# EasyEDA Pro project Motor_Sense_2025-12-15_V1.epro, board PCB_1
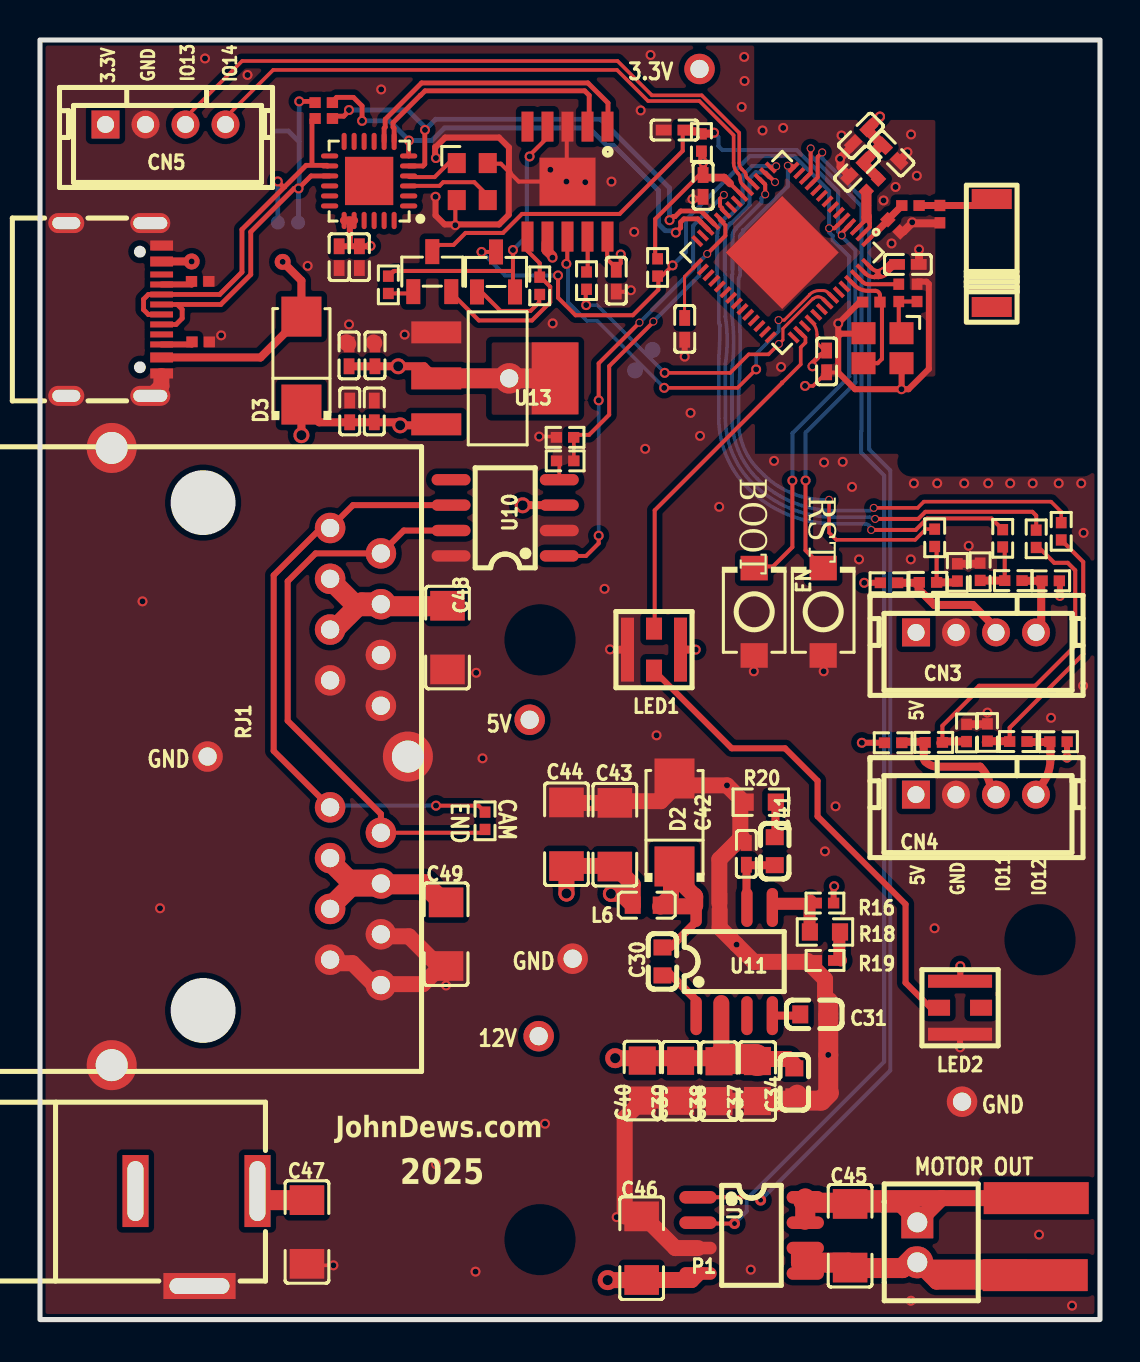
[diagram p3: board, top side]
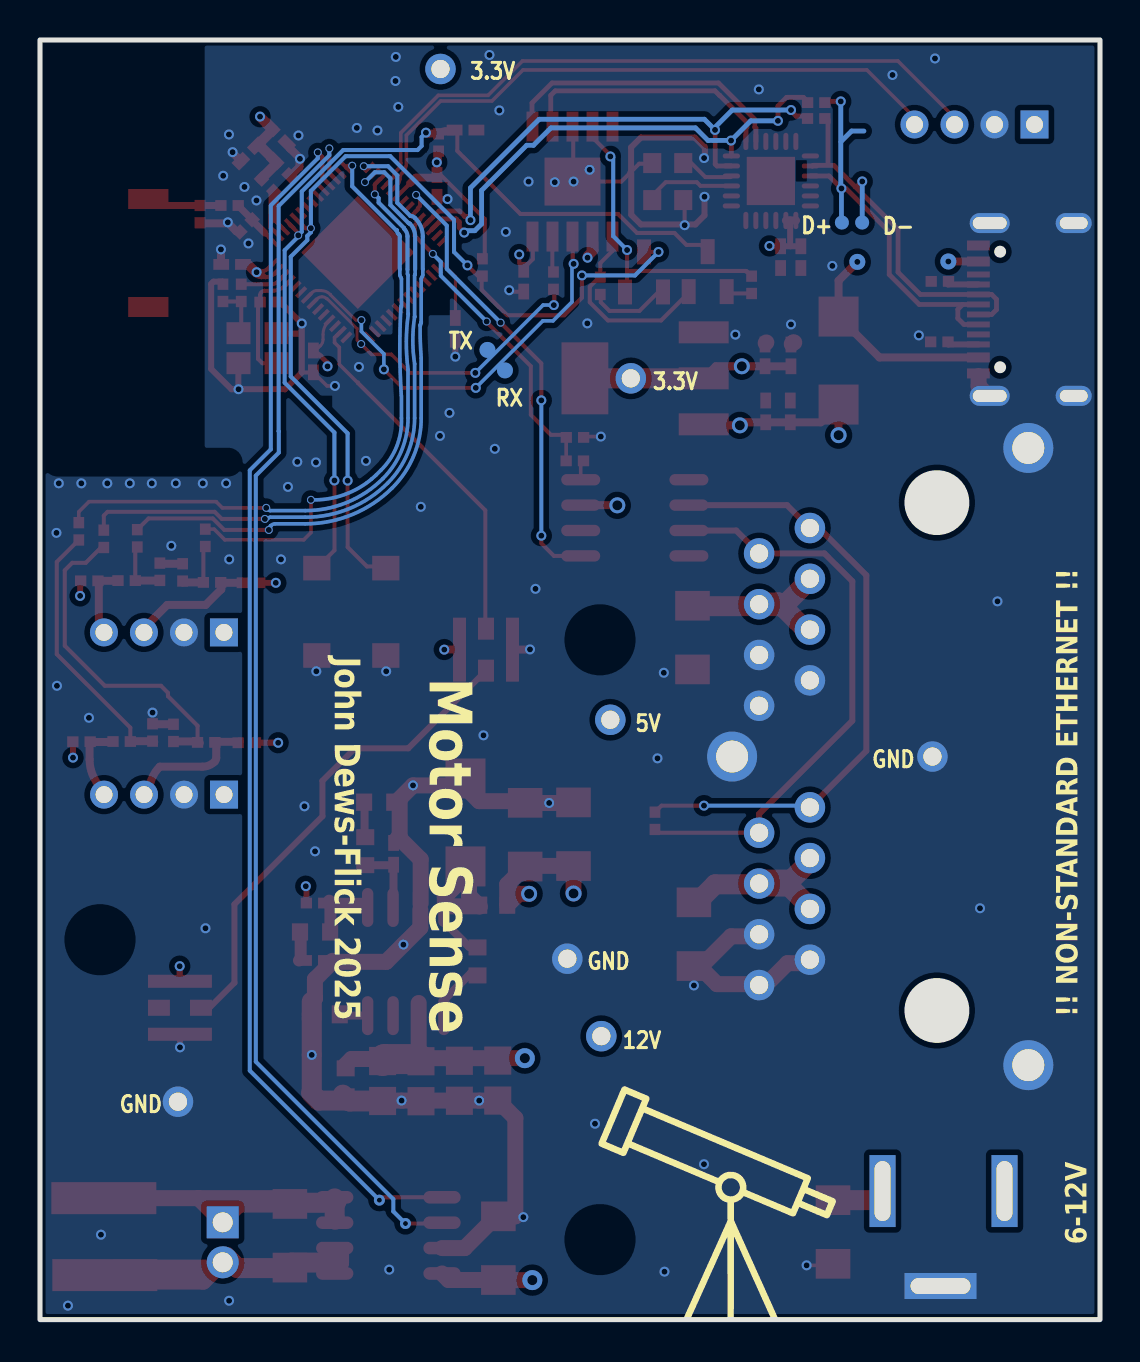
[diagram p4: board, bottom side, seen from below]

Outline 53 x 64 mm; copper layers: Top Layer, GND, VCC, Bottom Layer. Coordinates in mm from the lower left corner of the outline.
Outline path: rectangle 0,64 53,0
Stack: Top Layer 0.035mm Outer layer thickness 1oz / Dielectric1 0.2104mm 7628 RC49% 8.6mil / GND 0.0152mm 内层铜厚 / Dielectric2 1.065mm 1.1mm H/HOZ Copper / VCC 0.0152mm 内层铜厚 / Dielectric3 0.2104mm 7628 RC49% 8.6mil / Bottom Layer 0.035mm Outer layer thickness 1oz

## Design rules (mm)
net D4-: DP2
net D4+: DP2
net D3+: DP3
net D3-: DP3
net USB_D+: DP1
net USB_D-: DP1
template: 自定义配置
spacing copperThickness1oz (default): track to track 0.102, other pairs 0 to 0.3
spacing copperThickness2oz: track to track 0.203, other pairs 0.152 to 0.3
track width copperThickness1oz (default): min 0.152, default 0.203, max 2.54
track width copperThickness2oz: min 0.203, default 0.254, max 2.54
differential pair 90Ω (default): width min 0.241, default 0.241, max 0.241; gap min 0.152, default 0.152
via viaSize (default): diameter min 0.25, default 0.508, max 2.54; hole min 0.15, default 0.305, max 0.508

## Placement (name value [footprint] x y rotation side)
BOOT  TS-1088-AR02016  [SW-SMD_L3.9-W3.0-P4.45]  35.71 35.4 90 top
C1  8.2pF  [r0402]  43.52 55.72 180 top
C2  100nF  [C0402]  43.4 52.78 180 top
C3  10uF  [C0402]  41.05 59.21 45 top
C4  1uF  [C0402]  42.57 58.33 135 top
C5  100nF  [C0402]  40.85 57.56 45 top
C6  100nF  [C0402]  33.15 56.7 90 top
C7  100nF  [C0402]  39.33 47.92 90 top
C8  100nF  [C0402]  28.81 51.96 90 top
C9  10uF  [C0402]  14.96 53.14 90 top
C10  100nF  [C0402]  15.97 53.14 90 top
C11  100nF  [C0402]  32.23 49.55 90 top
C12  10pF  [R0402]  41.57 50.89 180 top
C13  1uF  [C0402]  31.72 59.5 0 top
C14  10pF  [R0402]  43.85 51.35 270 top
C15  10uF  [C0402]  16.75 48.23 270 top
C16  100nF  [C0402]  15.45 48.22 270 top
C17  10uF  [C0402]  15.48 45.42 270 top
C18  100nF  [C0402]  16.72 45.42 270 top
C30  100nF  [C0603]  31.12 17.91 90 top
C31  10nF  [C0603]  38.71 15.27 180 top
C34  10nF  [C0603]  37.72 11.87 90 top
C37  4.7uF  [C0805]  35.87 11.93 90 top
C38  4.7uF  [C0805]  33.95 11.92 90 top
C39  4.7uF  [C0805]  32.03 11.95 90 top
C40  4.7uF  [C0805]  30.11 11.95 90 top
C41  4.7nF  [C0603]  36.74 23.43 270 top
C42  33pF  [C0402]  35.32 23.3 270 top
C43  22uF  [C1206]  28.74 24.25 90 top
C44  22uF  [C1206]  26.32 24.27 90 top
C45  100nF  [C1206]  40.5 4.19 90 top
C46  100nF  [C1206]  30.08 3.57 90 top
C47  22uF  [C1206]  13.35 4.38 270 top
C48  100nF  [C1206]  20.38 34.11 90 top
C49  100nF  [C1206]  20.3 19.28 90 top
CN3  PH-4A  [CONN-TH_PH-4A]  46.8 34.37 0 top
CN4  PH-4A  [CONN-TH_PH-4A]  46.8 26.26 0 top
CN5  PH-4A  [CONN-TH_PH-4A]  6.28 59.77 0 top
D2  SS34  [SMA_L4.3-W2.6-LS5.2-RD]  31.73 24.86 90 top
D3  SS34  [SMA_L4.3-W2.6-LS5.2-RD]  13.07 47.97 90 top
EN  TS-1088-AR02016  [SW-SMD_L3.9-W3.0-P4.45]  39.16 35.4 90 top
L1  1.3nH  [r0402]  45 55.29 270 top
L2  39nH  [r0402]  42.7 54.71 315 top
L3  2nH  [R0402]  41.62 56.74 225 top
L4  24nH  [r0402]  42.94 51.35 270 top
L6  10uH  [L0603]  30.34 20.73 180 top
LED1  XL-3332RGBC-WS2812B  [LED-SMD_4P-L3.3-W3.2_XL-3332RGBC-WS2812B]  30.7 33.51 270 top
LED2  XL-3332RGBC-WS2812B  [LED-SMD_4P-L3.3-W3.2_XL-3332RGBC-WS2812B]  46 15.6 0 top
NOREF  -  [Pad_e433]  23.46 47.08 0 top
NOREF#2  -  [Pad_e755]  8.38 28.16 0 top
NOREF#3  -  [Pad_e2556]  29.75 47.47 0 top
NOREF#4  -  [Pad_e3200]  24.48 30 0 top
NOREF#5  -  [Pad_e3508]  46.1 10.9 0 top
NOREF#6  -  [Pad_e3152]  49.76 2.22 0 top
NOREF#7  -  [Pad_e3151]  49.81 6.07 0 top
NOREF#8  -  [Pad_e2540]  32.98 62.55 0 top
NOREF#9  -  [Pad_e2558]  30.63 48.5 0 top
NOREF#10  -  [Pad_e3207]  26.63 18.05 0 top
NOREF#11  -  [Pad_e3199]  24.93 14.18 0 top
P1  PH-2A  [CONN-TH_2P-P2.00_PH-2A_C2319]  43.86 3.86 90 top
Q1  MMBT3904(RANGE:100-300)  [SOT-23-3_L2.9-W1.3-P1.90-LS2.4-BR]  22.8 52.4 270 top
Q2  MMBT3904(RANGE:100-300)  [SOT-23-3_L2.9-W1.3-P1.90-LS2.4-BR]  19.62 52.41 270 top
R1  0Ω  [R0402]  14.19 60.87 0 top
R2  0Ω  [R0402]  14.19 60.07 0 top
R3  100Ω  [R0402]  27.33 51.96 90 top
R4  4.7kΩ  [R0402]  24.99 51.7 270 top
R5  4.7kΩ  [R0402]  17.42 51.75 270 top
R7  4.7kΩ  [R0402]  33.07 58.87 270 top
R8  4.7kΩ  [R0402]  30.88 52.62 90 top
R9  5.1kΩ  [R0402]  8.03 48.9 180 top
R10  5.1kΩ  [R0402]  8.01 51.93 180 top
R16  10kΩ  [R0402]  39.25 20.83 0 top
R18  1.8kΩ  [R0603]  39.25 19.39 180 top
R19  100Ω  [R0402]  39.25 17.96 0 top
R20  49.9Ω  [R0603]  36.04 25.88 0 top
R21  10kΩ  [R0402]  44.4 36.87 0 top
R22  20kΩ  [R0402]  45.87 37.37 90 top
R23  10kΩ  [R0402]  42.45 36.85 0 top
R24  10kΩ  [R0402]  48.67 36.96 180 top
R25  20kΩ  [R0402]  47.01 37.4 90 top
R26  10kΩ  [R0402]  50.53 36.95 180 top
R28  100Ω  [R0402]  44.73 39.1 90 top
R29  100Ω  [R0402]  48.13 39.08 90 top
R30  10kΩ  [R0402]  44.69 28.87 0 top
R31  20kΩ  [R0402]  46.33 29.34 90 top
R32  10kΩ  [R0402]  42.66 28.85 0 top
R33  10kΩ  [R0402]  48.92 28.91 180 top
R34  20kΩ  [R0402]  47.37 29.37 90 top
R35  10kΩ  [R0402]  50.93 28.9 180 top
R36  100Ω  [R0402]  49.81 39.05 90 top
R37  100Ω  [R0402]  51.06 39.43 90 top
R38  2kΩ  [R0402]  26.25 44.13 0 top
R39  1kΩ  [R0402]  26.26 42.95 180 top
R40  120Ω  [R0402]  22.25 24.95 270 top
RJ1  DS1129-05-S80BP-X  [RJ45-TH_DS1129-05-S80BP-X]  10.99 28.16 270 top
TP1  -  [test-point-0.5mm]  12.91 54.87 90 bottom
TP2  -  [test-point-0.5mm]  11.89 54.87 90 bottom
U1  RFANT5220110A0T  [FILTER-SMD_L5.2-W2.0-L]  47.59 53.35 90 top
U2  ESP32-S3FN8  [QFN-56_L7.0-W7.0-P0.40-TL-EP4.0]  37.11 53.37 225 top
U3  CH340K  [ESOP-10_L4.9-W3.9-P1.00-LS6.2-BL-EP]  26.37 56.92 180 top
U4  CH334F  [qfn24_4x4]  16.46 56.95 90 top
U6  USB-TYPE-C-019  [TYPE-C-SMD_HX-TYPE-C-16PIN]  3.7 50.52 270 top
U9  BL5617  [SOP-8_L4.9-W3.9-P1.27-LS6.0-BL]  35.58 4.21 270 top
U10  TJA1050T/CM,118  [SOIC-8_L5.0-W4.0-P1.27-LS6.0-BL]  23.26 40.1 90 top
U11  TPS54331DR  [SOIC-8_L5.0-W4.0-P1.27-LS6.0-BL]  34.71 17.91 0 top
U12  ZX-DC-WC2.56.3  [DC-TH_ZX-DC-WC2.56.3]  7.82 4.05 0 top
U13  AMS1117-3.3  [SOT-223-3_L6.5-W3.4-P2.30-LS7.0-BR]  22.78 47.08 180 top
X1  12MHz  [crystal-smd_4p-l2.5-w2.0-bl-a]  21.61 56.92 270 top
X2  40MHz  [crystal-smd_4p-l2.5-w2.0-bl]  42.12 48.58 180 top

## Footprints (pads in the part's own frame, mm; a bottom-side part is the same pattern mirrored in y, then rotated)
C0402
  rect 0.79x0.54 smd: 1(-0.545,0) 2(0.545,0)
C0603
  rect 0.8x0.9 smd: 1(-0.7,0) 2(0.7,0)
C0805
  rect 1.41x1.35 smd: 1(-1,0) 2(1,0)
C1206
  rect 1.485x1.728 smd: 1(-1.593,0) 2(1.593,0)
CONN-TH_2P-P2.00_PH-2A_C2319
  rect 1.6x1.6 hole 1: 1(1,0)
  round 1.6 hole 1: 2(-1,0)
CONN-TH_PH-4A
  rect 1.4x1.4 hole 0.85: 1(-3,0)
  round 1.4 hole 0.85: 2(-1,0) 3(1,0) 4(3,0)
crystal-smd_4p-l2.5-w2.0-bl
  rect 1.2x1.1 smd: 1(-0.95,-0.75) 2(0.95,-0.75) 3(0.95,0.75) 4(-0.95,0.75)
crystal-smd_4p-l2.5-w2.0-bl-a
  rect 1x0.9 smd: 1(-0.925,-0.775) 2(0.925,-0.775) 3(0.925,0.775) 4(-0.925,0.775)
DC-TH_ZX-DC-WC2.56.3
  rect 1.3x3.6 hole 0.8x3: 1(3.05,2.375) 2(-3.05,2.375)
  rect 3.6x1.3 hole 3x0.8: 3(0.15,-2.375)
ESOP-10_L4.9-W3.9-P1.00-LS6.2-BL-EP
  rect 0.6x1.5 smd: 1(-2,-2.75) 2(-1,-2.75) 3(0,-2.75) 4(1,-2.75) 5(2,-2.75) 6(2,2.75) 7(1,2.75) 8(0,2.75) 9(-1,2.75) 10(-2,2.75)
  rect 2.8x2.4 smd: 11(0,0)
FILTER-SMD_L5.2-W2.0-L
  rect 1x2 smd: 1(-2.7,0) 2(2.7,0)
L0603
  rect 0.8x0.864 smd: 1(-0.7,0) 2(0.7,0)
LED-SMD_4P-L3.3-W3.2_XL-3332RGBC-WS2812B
  rect 3.2x0.65 smd: 1(0,1.325) 4(0,-1.325)
  rect 1.1x0.8 smd: 2(-1.05,0) 3(1.05,0)
Pad_e433
  round 1.524 hole 0.914: 1(0,0)
Pad_e755
  round 1.524 hole 0.914: 1(0,0)
Pad_e2540
  round 1.524 hole 0.914: 2(0,0)
Pad_e2556
  round 0.8 smd far side: 1(0,0)
Pad_e2558
  round 0.8 smd far side: 1(0,0)
Pad_e3151
  custom 5.251x1.6 smd: 1(0,0)
Pad_e3152
  custom 5.251x1.6 smd: 1(0,0)
Pad_e3199
  round 1.524 hole 0.914: 1(0,0)
Pad_e3200
  round 1.524 hole 0.914: 2(0,0)
Pad_e3207
  round 1.524 hole 0.914: 1(0,0)
Pad_e3508
  round 1.524 hole 0.914: 1(0,0)
qfn24_4x4
  rect 2.413x2.413 smd: 0(0,0)
  oval 0.25x0.864 smd: 1(-1.25,-1.976) 2(-0.75,-1.976) 3(-0.25,-1.976) 4(0.25,-1.976) 5(0.75,-1.976) 6(1.25,-1.976) 13(1.25,1.976) 14(0.75,1.976) 15(0.25,1.976) 16(-0.25,1.976) 17(-0.75,1.976) 18(-1.25,1.976)
  oval 0.864x0.25 smd: 7(1.976,-1.25) 8(1.976,-0.75) 9(1.976,-0.25) 10(1.976,0.25) 11(1.976,0.75) 12(1.976,1.25) 19(-1.976,1.25) 20(-1.976,0.75) 21(-1.976,0.25) 22(-1.976,-0.25) 23(-1.976,-0.75) 24(-1.976,-1.25)
QFN-56_L7.0-W7.0-P0.40-TL-EP4.0
  rect 0.665x0.2 smd: 1(-3.408,2.6) 2(-3.407,2.2) 3(-3.408,1.8) 4(-3.408,1.4) 5(-3.408,1) 6(-3.407,0.6) 7(-3.408,0.2) 8(-3.408,-0.2) 9(-3.407,-0.6) 10(-3.408,-1) 11(-3.408,-1.4) 12(-3.408,-1.8) 13(-3.407,-2.2) 14(-3.408,-2.6) 29(3.408,-2.6) 30(3.407,-2.2) 31(3.408,-1.8) 32(3.408,-1.4) 33(3.408,-1) 34(3.407,-0.6) 35(3.408,-0.2) 36(3.408,0.2) 37(3.407,0.6) 38(3.408,1) 39(3.408,1.4) 40(3.408,1.8) 41(3.407,2.2) 42(3.408,2.6)
  rect 0.2x0.665 smd: 15(-2.6,-3.408) 16(-2.2,-3.407) 17(-1.8,-3.408) 18(-1.4,-3.408) 19(-1,-3.408) 20(-0.6,-3.407) 21(-0.2,-3.408) 22(0.2,-3.408) 23(0.6,-3.407) 24(1,-3.408) 25(1.4,-3.408) 26(1.8,-3.408) 27(2.2,-3.407) 28(2.6,-3.408) 43(2.6,3.408) 44(2.2,3.407) 45(1.8,3.408) 46(1.4,3.408) 47(1,3.408) 48(0.6,3.407) 49(0.2,3.408) 50(-0.2,3.408) 51(-0.6,3.407) 52(-1,3.408) 53(-1.4,3.408) 54(-1.8,3.408) 55(-2.2,3.407) 56(-2.6,3.408)
  rect 4x4 smd: 57(0,0)
r0402
  rect 0.566x0.54 smd: 1(-0.433,0) 2(0.433,0)
R0402
  rect 0.566x0.54 smd: 1(-0.433,0) 2(0.433,0)
R0603
  rect 0.806x0.864 smd: 1(-0.753,0) 2(0.753,0)
RJ45-TH_DS1129-05-S80BP-X
  round 1.524 hole 0.914: 1(-11.43,3.515) 2(-10.16,6.055) 3(-8.89,3.515) 4(-7.62,6.055) 5(-6.35,3.515) 6(-5.08,6.055) 7(-3.81,3.515) 8(-2.54,6.055) 9(2.54,3.515) 10(3.81,6.055) 11(5.08,3.515) 12(6.35,6.055) 13(7.62,3.515) 14(8.89,6.055) 15(10.16,3.515) 16(11.43,6.055)
  round 2.5 hole 1.6: 17(-15.435,-7.405) 18(15.435,-7.405) 19(0.001,7.405)
SMA_L4.3-W2.6-LS5.2-RD
  rect 2x2 smd: 1(-2.2,0) 2(2.2,0)
SOIC-8_L5.0-W4.0-P1.27-LS6.0-BL
  oval 0.569x1.95 smd: 1(-1.905,-2.705) 2(-0.635,-2.705) 3(0.635,-2.705) 4(1.905,-2.705) 5(1.905,2.705) 6(0.635,2.705) 7(-0.635,2.705) 8(-1.905,2.705)
SOP-8_L4.9-W3.9-P1.27-LS6.0-BL
  oval 0.63x1.865 smd: 1(-1.905,-2.683) 2(-0.635,-2.683) 3(0.635,-2.683) 4(1.905,-2.683) 5(1.905,2.683) 6(0.635,2.683) 7(-0.635,2.683) 8(-1.905,2.683)
SOT-23-3_L2.9-W1.3-P1.90-LS2.4-BR
  rect 1.25x0.7 smd: 1(1,-0.95) 2(1,0.95) 3(-1,0)
SOT-223-3_L6.5-W3.4-P2.30-LS7.0-BR
  rect 2.5x1.1 smd: 1(2.97,-2.3) 2(2.97,0) 3(2.97,2.3)
  rect 2.34x3.6 smd: 4(-2.97,0)
SW-SMD_L3.9-W3.0-P4.45
  rect 1.23x1.36 smd: 1(-2.185,0) 2(2.185,0)
test-point-0.5mm
  round 0.7 smd: 1(0,0)
TYPE-C-SMD_HX-TYPE-C-16PIN
  oval 1x2 hole 0.6x1.7: 1(-4.32,1.816) 1(4.32,1.816)
  oval 1x1.8 hole 0.6x1.4: 1(-4.32,-2.384) 1(4.32,-2.384)
  rect 0.5x1.14 smd: A1(-3.2,2.384) A4(-2.4,2.384) A9(2.4,2.384) A12(3.2,2.384)
  rect 0.3x1.14 smd: A5(-1.25,2.383) A6(-0.25,2.383) A7(0.25,2.383) A8(1.25,2.384) B5(1.75,2.383) B6(0.75,2.383) B7(-0.75,2.383) B8(-1.75,2.384)

## Nets
As in the schematic, except:
3V3: C2.2 C3.2 C4.2 C5.2 C6.2 C7.2 C8.2 C9.2 C10.2 C15.2 C16.2 CN5.1 L3.1 NOREF.1 NOREF#8.2 R7.2 R8.2 U2.20 U2.46 U2.55 U2.56 U3.7 U3.10 U4.19 U4.20 U13.2 U13.4
12V: C34.2 C37.2 C38.2 C39.2 C40.2 C46.1 C47.1 C48.2 C49.2 NOREF#11.1 RJ1.3 RJ1.4 RJ1.5 RJ1.11 RJ1.12 RJ1.13 U9.4 U11.2 U12.1
+5V: C17.2 C18.2 C43.1 C44.1 CN3.1 CN4.1 D3.1 L6.2 LED1.1 LED2.1 NOREF#4.2 R16.2 R23.1 R26.1 R32.1 R35.1 U10.3 U13.3
GND: BOOT.1 C2.1 C3.1 C4.1 C5.1 C6.1 C7.1 C8.1 C9.1 C10.1 C11.1 C12.2 C13.1 C14.1 C15.1 C16.1 C17.1 C18.1 C31.1 C34.1 C37.1 C38.1 C39.1 C40.1 C42.1 C43.2 C44.2 C46.2 C47.2 C48.1 C49.1 CN3.2 CN4.2 CN5.2 D2.2 EN.1 L1.2 L2.2 LED1.4 LED2.4 NOREF#2.1 NOREF#5.1 NOREF#10.1 R9.1 R10.1 R19.1 R20.1 R22.2 R25.2 R31.2 R34.2 R38.1 RJ1.6 RJ1.7 RJ1.8 RJ1.14 RJ1.15 RJ1.16 RJ1.17 RJ1.18 RJ1.19 U2.57 U3.3 U3.11 U4.0 U6.1 U6.A1 U6.A12 U9.3 U10.2 U10.8 U11.7 U12.3 U13.1 X1.2 X1.4 X2.2 X2.4
340_TX: NOREF#3.1 U2.50 U3.8
M_OUTA: C45.2 NOREF#7.1 P1.1 U9.7 U9.8
M_OUTB: C45.1 NOREF#6.1 P1.2 U9.5 U9.6
U0TX: NOREF#9.1 R3.1 U2.49

Pads without a net: U1 1; U2 28 30 31 32 33 34 35 38 39 40 41 42; U3 5; U4 1 2 9 10 11 12 13 16 17 18 21 22 23 24; U6 A8 B8; U10 5; U11 3; U12 2

## Via types
v1: diameter 0.5, hole 0.3, Top Layer to Bottom Layer, 132 vias
v2: diameter 0.8, hole 0.5, Top Layer to Bottom Layer, 6 vias
v3: diameter 0.4, hole 0.3, Top Layer to Bottom Layer, 18 vias
v4: diameter 1, hole 0.508, Top Layer to Bottom Layer, 2 vias
v5: diameter 0.55, hole 0.25, Top Layer to Bottom Layer, 2 vias
v6: diameter 0.8, hole 0.3, Top Layer to Bottom Layer, 2 vias

## Routing (per net, layer and track width the routed paths; a pad name or vN(x,y) marks a point on that pad's centre or on a via; arc(x,y) is an arc through that point)
3V3: length 40.4
  Top Layer w0.152: 38.98,48.71 39.33,48.36 ; U2.46 38.58,49.92 arc(38.78,49.62) 38.85,49.27 38.85,49.02 arc(38.88,48.85) 38.98,48.71
  Top Layer w0.2: 15.21,54.97 15.21,55.27 ; 15.89,53.74 15.91,53.72
  Top Layer w0.203: 28.8,52.6 28.36,53.04 28.36,54.12 ; 28.8,52.6 28.81,52.58 ; 28.8,52.6 28.77,52.56 ; 28.8,52.6 29.03,52.83 29.03,53.25 ; 42.24,52.61 42.48,52.85 arc(42.58,52.92) 42.71,52.94 ; 42.24,52.61 arc(42.16,52.54) 42.08,52.5 ; 42.24,52.61 arc(42.34,52.66) 42.44,52.7 ; 42.24,52.61 arc(42.16,52.55) 42.08,52.5 ; 41.92,52.14 v1(42.17,52.39) 42.41,52.63 arc(42.44,52.66) 42.44,52.7 ; 41.92,52.14 41.72,52.14 ; 41.92,52.14 arc(42.16,52.19) 42.35,52.32 42.7,52.67 arc(42.82,52.75) 42.96,52.78 42.86,52.78 arc(42.65,52.76) 42.44,52.7 ; 15.85,53.67 15.85,53.74 15.89,53.74 ; 41.83,52.44 41.84,52.44 arc(41.97,52.46) 42.08,52.5 ; 41.83,52.44 arc(41.91,52.43) 42,52.42 ; 41.83,52.44 arc(41.68,52.5) 41.55,52.6 U2.56 ; 34.5,56.86 34.5,56.82 U2.20 ; U2.55 41.26,52.33 arc(41.47,52.19) 41.72,52.14 ; 30.76,53.03 30.76,55.05 32.96,57.25 ; 41.72,52.14 42,52.42 ; 42,52.42 arc(42.04,52.46) 42.08,52.5
  Top Layer w0.241: v1(38.62,47.68) 38.62,47.85 38.99,48.21 arc(39.14,48.32) 39.33,48.36
  Top Layer w0.3: 15.47,53.68 15.49,53.7 15.49,54.97 ; 15.47,53.68 16.51,53.68 v1(16.53,53.7) ; 15.47,53.68 14.91,53.68
  Top Layer w0.381: v1(33.16,57.88) 33.16,57.12 34.21,57.12 34.5,56.82
  Top Layer w0.4: U4.19 U4.20 ; C16.2 16.75,47.68 C15.2 v2(17.91,47.68) 19.21,47.68 U13.2 ; 33.12,58.47 33.12,57.94 33.15,57.91
  Top Layer w0.5: 25.61,53.19 25.33,53.48 25.33,53.86
  Top Layer w0.508: 42.26,58.63 42.24,58.63 42.08,58.79 ; 42.08,58.79 41.16,57.87 41.16,57.84 41.95,57.05 ; 42.08,58.79 41.35,59.52 v1(42,60.17)
  Top Layer w1: U13.4 NOREF.1 U13.2
  vias: v1(25.62,53.11) v1(29.04,53.27)
12V: length 41.3
  Top Layer w0.8: 34.07,12.97 34.07,13.03 ; 34.07,12.97 33.99,12.89 ; 34.07,12.97 34.07,12.86 ; 37.75,12.71 37.43,13.03 34.07,13.03 ; 34.07,13.08 34.07,13.03 ; 34.07,13.08 v4(28.76,13.08) ; 34.07,13.08 34.07,15.83 ; U9.4 32.57,1.98 29.23,1.98 29.23,1.97 v4(28.38,1.97)
  Top Layer w1: 15.89,35.68 14.61,34.4 ; 15.89,35.68 17.06,35.68 ; 15.89,35.68 15.84,35.68 14.39,37.12 ; 15.89,35.68 16.08,35.87 17.06,35.87 ; 14.61,23.04 14.39,23.04 ; 14.39,23.04 15.43,22.01 16.99,22.01 ; 14.39,23.04 14.36,23.08 ; 17.06,35.68 20.55,35.68 ; 17.06,35.68 16.92,35.82 ; 14.36,20.48 15.54,21.66 17.01,21.66 ; U12.1 11.33,5.98 C47.1 ; 16.99,21.77 19.24,21.77 20.11,20.9
  Top Layer w1.5: 34.07,13.03 35.77,13.03 C37.2
+5V: length 23.9
  Top Layer w0.3: R35.1 51.35,28.9 v1(51.35,28.11) ; LED2.1 46.02,16.94 v1(46.02,17.68) ; R16.2 39.68,21.65 v1(39.71,21.68) ; v1(41.21,36.85) 42.01,36.85 ; v1(41.09,28.85) R32.1 ; R26.1 51,36.92 v1(51,36.2)
  Top Layer w0.4: U13.3 19.76,44.73 v2(18.01,44.73) 17.86,44.88 C18.2 C17.2 13.96,44.88 D3.1 v2(13.07,44.24) ; 25.96,40.74 24.14,40.74 v2(24.13,40.73) ; v1(32.79,33.51) LED1.1
  Top Layer w0.8: 26.44,22.65 26.4,22.69 ; 26.4,22.69 28.7,22.69 ; 26.4,22.69 26.25,22.69 ; v2(26.32,21.31) C44.1 ; v2(28.54,21.3) 29.07,21.3 L6.2 29.64,21.76 C43.1
GND: length 118.7
  Top Layer w0.18: v1(28.83,5.12) 29.19,5.12 29.23,5.16 ; v1(24.96,44.17) 25.73,44.17 25.82,44.25 ; C7.1 38.65,46.7 v1(38.25,46.7) ; C47.2 13.42,2.71 v1(14.67,2.71)
  Top Layer w0.203: 28.82,51.41 29.47,51.41 29.56,51.49 ; 23.48,57.37 23.93,56.92 v1(26.32,56.92) 26.34,56.94 26.34,59.28 ; 23.45,57.4 23.04,57.81 22.28,57.81 ; 39.3,47.37 39.93,47.37 39.95,47.38 ; v1(20.3,16.71) C49.1 ; v1(20.77,54.74) 20.77,54.77 ; 20.77,54.77 20.77,55.91 20.86,56
  Top Layer w0.3: v1(32.23,48.16) C11.1 ; 19.76,58.66 19.76,58.14 v1(19.8,58.1) ; 41.11,49.31 40.05,49.31 39.97,49.23 ; 43.85,51.89 43.88,51.91 44.33,51.91 44.44,51.8 44.44,47.55 43.43,46.53 v1(43.07,46.53) 40.75,46.53 39.91,47.37 v1(39.91,49.82) 40.95,50.86 41,50.86 ; 42.86,47.78 43.08,47.55 43.08,46.56 ; 23.45,57.35 23.45,58.63 22.95,59.12 20.26,59.12 19.78,58.64 ; v1(46,13.62) LED2.4 ; 33.18,56.06 33.18,56.05 32.68,56.05 ; 23.44,57.32 23.44,55.26 22.95,54.77 20.23,54.77 19.78,55.23 v1(19.78,56.16) ; 23.47,57.38 23.48,57.37
  Top Layer w0.4: 43.95,53.47 43.95,52.93 43.86,52.83 ; 43.66,54.83 44.92,54.83 44.94,54.86 ; v1(28.5,33.52) 28.51,33.51 LED1.4 ; 39.97,58.05 40.06,58.14 ; 40.06,58.14 40.03,58 40.03,57.65 40.5,57.18 ; 40.06,58.14 40.51,58.59 40.51,58.68 ; R31.2 47.37,29.78 R34.2 ; 43.34,58.32 43.33,58.32 42.91,57.9 ; 43.03,54.43 43.18,54.43 43.56,54.81 ; R22.2 47.01,37.8 R25.2
  Top Layer w0.8: 20,17.62 18.45,19.17 16.99,19.17 ; 20,17.62 20.06,17.55 ; 20,17.62 20.2,17.83 ; 20,17.62 19.15,16.78 16.97,16.78 ; 39.41,15.9 39.25,16.06 39.25,17.02 38.45,17.82 ; 35.02,26.01 35.02,24.16 35.06,24.12 ; 39.41,15.06 39.41,15.06 ; 35.06,24.12 35.17,24.01 ; 35.06,24.12 33.97,23.02 33.97,20.82 ; 35.06,24.12 35.08,24.13 ; 38.37,17.94 38.32,17.89 35.69,17.89 v1(34.83,18.75) 33.98,19.6 33.98,20.48 ; 28.75,25.93 28.66,25.84 v1(27.54,25.84) 26.63,25.84 ; 28.75,25.93 31.04,25.93 31.8,26.69 ; 28.75,25.93 28.71,25.93 ; 28.75,25.93 28.84,26.02 ; 15.29,48.87 15.33,48.87 15.41,48.79 ; 31.62,26.72 v1(34.35,26.72) 35.14,25.93 ; 16.68,48.87 16.72,48.84 ; 14.51,17.83 15.63,17.83 17.08,16.37 ; 5.58,46.21 6.07,46.69 6.07,47.19 ; U9.3 31.77,3.58 30.18,5.16 29.23,5.16 29.23,10.08 C40.1 v1(31.04,10.95) v1(34.92,10.95) 37.51,10.95
  Top Layer w1: 35.99,10.95 36.01,10.93 ; 35.99,10.95 35.84,10.95 ; 35.99,10.95 37.56,10.95 ; 37.56,10.95 37.52,10.91 35.72,10.91 ; 37.56,10.95 37.86,11.25 ; 37.56,10.95 39.06,10.95 39.45,11.34 ; 39.41,15.9 C31.1 v1(39.41,13.24) 39.41,11.34
  vias: v1(5.13,35.92) v1(6,20.57) v1(8.25,63.08) v1(9.06,49.23) v1(10.38,62.25) v1(13.38,52.7) v1(15.45,49.77) v1(17.06,61.53) v1(18.23,49.26) v1(19.8,7.77) v1(21.81,32.35) v1(21.78,2.4) v1(22.13,28.07) v1(25.25,9.8) v1(25.52,57.51) v1(25.63,49.83) v1(27.26,56.89) v1(28.23,36.55) v1(28.57,56.92) v1(29.54,51.48) v1(29.71,54.4) v1(30.03,60.48) v1(30.26,43.55) v1(30.53,63.25) v1(30.83,29.22) v1(32.53,45.35) v1(32.62,56.04) v1(33,44.2) v1(33.96,40.65) v1(35.08,60.65) v1(35.21,63.15) v1(35.23,61.95) v1(35.54,2.5) v1(35.69,32.42) v1(36.13,59.47) v1(36.7,42.95) v1(37.05,47.65) v1(37.16,59.6) v1(39.2,42.87) v1(39.18,32.43) v1(39.25,23.42) v1(39.78,25.67) v1(40,58.06) v1(40.08,59.22) v1(40.13,42.9) v1(40.6,41.65) v1(40.95,38.02) v1(42.18,55.97) v1(42.58,53.82) v1(42.78,56.65) v1(43.37,58.39) v1(43.55,59.27) v1(43.54,38.02) v1(43.55,0.94) v1(43.61,54.88) v1(43.69,41.83) v1(43.84,57.21) v1(43.95,53.53) v1(44.73,19.57) v1(44.86,41.83) v1(46.21,41.83) v1(46.44,38.7) v1(47.41,41.83) v1(47.37,30.36) v1(48.51,41.83) v1(49.63,41.83) v1(49.95,4.25) v1(50.55,30.1) v1(50.94,41.83) v1(51.6,0.7) v1(52.06,41.83) v1(52.15,31.7) v1(52.18,39.35)
VDD_SPI: length 3.1
  Top Layer w0.152: 32.23,49.99 32.23,52.17 32.85,52.79 32.85,52.8
340_RX: length 1.9
  Top Layer w0.203: 27.31,52.31 27.38,52.39 27.38,54.18
340_TX: length 21.1
  Top Layer w0.152: U2.50 39.39,51.37 arc(39.28,51.44) 39.16,51.47 38.96,51.47 arc(38.7,51.42) 38.48,51.27 38.48,51.26 37.21,49.99 v3(36.93,49.99)
  Top Layer w0.18: v1(31.21,46.6) 34.88,46.6 v1(35.81,47.53)
  Top Layer w0.203: 26.36,53.99 26.36,52.87 26.27,52.77
  Bottom Layer w0.18: v3(36.93,49.99) 36.93,49.42 35.81,48.3 v1(35.81,47.53) ; v1(31.21,46.6) 27.86,49.95 27.35,49.95 26.4,50.9 26.4,52.72 v1(26.32,52.8)
CANH: length 29
  Top Layer w0.2: 17.04,24.35 22.09,24.35 R40.2
  Top Layer w0.3: U10.7 18.19,39.47 17.04,38.32 13.78,38.32 12.38,36.93 12.38,29.95 17.04,25.29 17.04,24.35
CANL: length 31
  Top Layer w0.2: R40.1 21.93,25.71 v1(19.8,25.71)
  Top Layer w0.3: RJ1.9 11.68,28.44 11.68,37.23 14.05,39.59 RJ1.1 15.65,40.74 20.55,40.74
  Bottom Layer w0.2: v1(19.8,25.71) 14.59,25.71 RJ1.9
CHIP_PU: length 46.3
  Top Layer w0.2: v1(38.28,41.97) 38.28,41.97 38.28,38.47 39.16,37.59 arc(39.16,37.59) EN.2
  Top Layer w0.203: 32.29,59.49 32.13,59.33 32.13,58.45 28.98,55.3 24.1,55.3 23.15,54.35 21.28,54.35 20.68,53.75 19.95,53.75 Q2.3 ; v3(40.09,54.23) 40.03,54.28 40.03,54.28 ; 40.01,54.34 40.07,54.34 40.02,54.28 40.03,54.28 ; 40.03,54.28 40.47,54.73 40.47,54.73 40.53,54.8
  Top Layer w0.4: 33.01,59.32 33.05,59.32 ; 33.05,59.32 33.62,59.32 arc(33.66,59.33) 33.7,59.35 ; 33.05,59.32 arc(32.9,59.4) 32.73,59.43 32.31,59.43 ; 33.05,59.32 arc(33.07,59.3) 33.09,59.28
  Bottom Layer w0.2: v1(38.28,41.97) 38.28,44.37 40.77,46.86 40.77,53.49 40.14,54.11
  Bottom Layer w0.203: v1(33.7,59.36) 33.92,59.15 33.92,58.7 34.12,58.5 37.84,58.5 39.91,56.42 39.91,54.41 v3(40.09,54.23)
D3+: length 14.1
  Top Layer w0.241: U4.8 17.21,59.59 17.26,59.64 17.26,60.03 19.08,61.85 27.4,61.85 28.4,60.85 28.4,60.18
D3-: length 12.8
  Top Layer w0.241: U4.7 17.71,59.59 17.65,59.64 17.65,59.87 19.02,61.23 19.03,61.23 19.25,61.46 27.23,61.46 27.46,61.23 27.46,60 27.5,59.96
D4+: length 25
  Top Layer w0.241: v1(18.45,58.97) 18.43,58.95 U4.6 ; v1(16.1,59.96) 16.1,60.7 15.67,61.13 14.83,61.13 14.66,60.96 ; v1(31.79,54.37) 32.03,54.61 32.03,54.89 32.19,55.05 32.89,55.05 33.05,54.89 33.05,54.89 U2.26
  Bottom Layer w0.241: v1(31.79,54.37) 31.7,54.46 31.26,54.46 30.92,54.8 30.92,56.48 28.66,58.73 28.32,58.73 27.46,59.6 20.23,59.6 19.6,58.98 18.45,58.98 v1(18.45,58.97) 17.46,59.96 v1(16.1,59.96)
D4-: length 25.9
  Top Layer w0.241: v1(19.25,59.5) 19.24,59.49 19.24,57.79 19.15,57.7 U4.5 ; v1(31.48,54.99) 31.66,55.17 31.75,55.17 32.03,55.45 33.05,55.45 33.33,55.17 33.33,55.17 33.71,54.79 ; 15.44,60.44 15.19,60.19 14.64,60.19
  Bottom Layer w0.241: v1(31.48,54.99) 31.48,56.6 28.04,60.03 19.78,60.03 v1(19.25,59.5) 19.25,59.63 18.39,60.5 v1(15.45,60.5)
DTR: length 14.9
  Top Layer w0.2: v1(23.65,53.5) 23.65,51.5 23.75,51.4
  Top Layer w0.203: 23.65,52.45 17.73,52.45 17.7,52.42 17.66,52.42 R5.1 ; v1(24.48,58.18) 24.48,58.23 25.37,59.12
  Bottom Layer w0.203: v1(23.65,53.5) 24.34,54.19 24.34,58.11 24.4,58.18 v1(24.48,58.18)
GPIO0: length 48.1
  Top Layer w0.2: v1(37.62,41.96) 37.62,38.64 36.65,37.67 35.74,37.67 arc(35.73,37.62) BOOT.2
  Top Layer w0.203: 30.92,52.25 30.92,51.51 29.64,50.23 26.78,50.23 25.9,51.11 v1(25.9,52.22) ; v1(31.63,52.73) 31.01,52.11 30.92,52.11 ; 40.13,54.97 39.89,54.74 39.88,54.74 39.73,54.59 v3(39.46,54.59) ; v1(22.08,53.4) Q1.3
  Bottom Layer w0.203: v1(37.62,41.96) 37.62,44.33 40.46,47.17 40.46,53.16 39.63,53.99 39.63,54.2 39.46,54.38 39.46,56.45 37.72,58.19 35.49,58.19 32.3,55 32.3,53.4 v1(31.63,52.73) ; v1(22.08,53.4) 23.25,52.22 v1(25.9,52.22)
GPIO6: length 61.5
  Top Layer w0.2: v5(36.03,5.97) 35.89,6.12 U9.1 ; U2.11 38.88,57.13 38.88,58.15 v3(39.11,58.38)
  Bottom Layer w0.2: v5(36.03,5.97) 42.51,12.45 42.51,42.47 41.46,43.53 41.46,55.73 39.11,58.08 v3(39.11,58.38)
GPIO7: length 61.9
  Top Layer w0.2: U9.2 32.94,4.8 v5(34.73,4.8) ; U2.12 38.53,57.34 v3(38.53,58.58)
  Bottom Layer w0.2: v5(34.73,4.8) 35.33,5.41 35.33,6.02 42.21,12.9 42.21,42.21 41.06,43.36 41.06,44.43 41.07,44.43 41.07,55.7 38.53,58.23 v3(38.53,58.58)
GPIO9: length 28.1
  Top Layer w0.18: v3(39.45,41) 39.45,39.36 39.81,39 43.76,39 44.29,39.53 R28.2
  Top Layer w0.203: v3(37.39,57.71) 37.59,57.71 U2.14
  Bottom Layer w0.18: 35.01,52.53 35.01,52.25 arc(35,52.19) 34.97,52.15 arc(34.94,52.11) 34.93,52.05 34.93,50.63 ; 34.93,46.2 34.93,45.09 arc(35.16,43.67) 35.96,42.48 36.21,42.23 arc(36.31,42.13) 36.42,42.04 arc(37.84,41.24) v3(39.45,41) ; 34.95,50.68 arc(35.01,48.45) 34.93,46.23
  Bottom Layer w0.203: 35.01,52.53 35.01,54.17 arc(35.02,54.22) 35.05,54.27 35.08,54.3 arc(35.14,54.39) 35.16,54.49 35.19,54.49 37.39,56.68 v3(37.39,57.71)
GPIO10: length 32.9
  Top Layer w0.2: v3(41.56,39.49) 43.78,39.49 44.36,40.07 47.57,40.07 R29.2
  Top Layer w0.203: v3(36.81,57.69) 36.74,57.62 U2.15
  Bottom Layer w0.18: 33.86,52.53 33.86,52.25 arc(33.87,52.19) 33.9,52.15 arc(33.93,52.11) 33.94,52.05 33.94,49.89 ; 33.94,49.89 33.94,49.85 arc(33.97,49.78) 33.98,49.7 ; 33.94,49.89 arc(33.97,49.82) 33.99,49.74 arc(33.98,48.91) 33.94,48.08 33.94,45.09 arc(34.31,43.2) 35.38,41.6 arc(37.38,40.27) 39.73,39.8 41.23,39.8 arc(41.36,39.78) 41.47,39.7 arc(41.46,39.69) 41.47,39.68 ; 33.94,49.89 arc(33.94,49.9) 33.93,49.9 ; 41.47,39.68 arc(41.48,39.69) 41.48,39.7 arc(41.47,39.69) 41.47,39.68 ; 41.47,39.68 arc(41.49,39.58) v3(41.56,39.49)
  Bottom Layer w0.203: 33.86,52.53 33.86,54.17 arc(33.96,54.66) 34.23,55.08 34.27,55.11 arc(34.37,55.18) 34.48,55.2 35.13,55.85 35.13,57.23 35.59,57.69 v3(36.81,57.69)
GPIO11: length 34.1
  Top Layer w0.2: 49.81,39.48 49.81,40.21 49.62,40.4 44.27,40.4 43.91,40.05 v3(41.76,40.05)
  Top Layer w0.203: 36.25,57.34 36.31,57.34 v3(36.75,56.89)
  Bottom Layer w0.18: 34.27,50.15 34.27,52.23 arc(34.27,52.24) 34.26,52.26 arc(34.25,52.27) 34.24,52.29 34.24,52.53 ; 34.27,50.15 34.27,50.14 ; 34.27,50.15 arc(34.26,50.17) 34.26,50.18 ; 34.27,50.15 arc(34.36,48.98) 34.27,47.8 34.27,45.09 arc(34.62,43.33) 35.62,41.83 arc(37.5,40.57) 39.73,40.13 41.48,40.13 arc(41.54,40.12) 41.59,40.09 arc(41.64,40.06) 41.69,40.05 ; 41.69,40.05 v3(41.76,40.05)
  Bottom Layer w0.203: 34.24,52.53 34.24,54.17 arc(34.31,54.52) 34.5,54.81 34.51,54.82 arc(34.53,54.82) 34.54,54.83 arc(34.56,54.83) 34.57,54.84 35.48,55.75 35.48,57.08 35.78,57.38 36.26,57.38 v3(36.75,56.89)
GPIO12: length 32.7
  Top Layer w0.18: v3(41.69,40.6) 43.88,40.6 44.19,40.91 50.55,40.91 51.06,40.4 R37.2
  Top Layer w0.203: U2.17 35.98,57.05 36.25,56.79 36.25,56.78 36.26,56.76 v3(36.26,56.28)
  Bottom Layer w0.18: 34.6,50.28 34.6,52.23 arc(34.6,52.24) 34.61,52.26 arc(34.62,52.27) 34.63,52.29 34.63,52.53 ; v3(41.69,40.6) 41.69,40.55 41.69,40.55 ; 41.69,40.55 arc(41.64,40.54) 41.59,40.5 arc(41.54,40.47) 41.48,40.46 39.73,40.46 arc(37.63,40.88) 35.85,42.07 arc(34.92,43.46) 34.6,45.09 34.6,47.52 arc(34.68,48.91) 34.58,50.3
  Bottom Layer w0.203: 34.63,52.53 34.63,54.17 arc(34.66,54.37) 34.78,54.54 arc(34.79,54.55) 34.79,54.57 arc(34.79,54.59) 34.8,54.6 36.07,55.87 36.07,56.09 v3(36.26,56.28)
GPIO13: length 33.6
  Top Layer w0.18: CN5.3 7.21,59.84 7.21,60.05 10.11,62.95 28.88,62.95 30.59,61.23 33.09,61.23 34.96,59.35 34.96,57.85 arc(35,57.68) 35.09,57.54 35.23,57.39 arc(35.28,57.33) 35.29,57.25 arc(35.31,57.17) 35.35,57.11 U2.18
GPIO14: length 31.1
  Top Layer w0.18: CN5.4 9.21,59.84 9.21,60.05 11.66,62.5 28.85,62.5 30.4,60.95 32.97,60.95 34.68,59.24 34.68,57.85 arc(34.74,57.57) 34.89,57.34 arc(34.98,57.21) 35.01,57.05 arc(35.04,56.9) 35.13,56.77 U2.19
GPIO17: length 23.3
  Top Layer w0.2: v3(29.97,49.86) 27.93,47.83 v1(27.93,45.98) ; v1(27.93,39.21) 27.93,38.83 27.3,38.2 U10.1 ; v3(34.19,56.25) 34,56.06 34,55.7 34.11,55.59 34.11,55.52 34.28,55.36
  Bottom Layer w0.2: v3(34.19,56.25) 32.66,54.72 32.66,52.55 v3(29.97,49.86) ; v1(27.93,45.98) v1(27.93,39.21)
GPIO18: length 15.7
  Top Layer w0.18: 26.68,44.25 26.69,44.24 26.69,43.05
  Top Layer w0.2: 30.69,49.92 28.46,47.69 28.46,45.26 27.45,44.25 26.68,44.25 ; U2.24 33.99,55.01 34.27,54.73 34.27,54.21 v3(33.36,53.3)
  Bottom Layer w0.2: v3(33.36,53.3) 32.96,52.9 32.96,52.21 v3(30.67,49.92)
GPIO39: length 18.2
  Top Layer w0.18: U2.44 37.98,49.41 38.27,49.12 38.27,48.86 38.03,48.63 38.03,47.78 37.1,46.85
  Top Layer w0.2: LED1.2 30.73,34.59 30.73,40.48 37.1,46.85 37.1,46.88
LED_1: length 24.6
  Top Layer w0.3: LED1.3 34.59,28.57 37.25,28.57 38.88,26.95 38.88,25.17 43.28,20.77 43.28,16.85 44.53,15.6 LED2.2
M_OUTA: length 18.4
  Top Layer w0.8: 45.07,6.07 49.88,6.07 ; 45.07,6.07 40.79,6.07 40.58,5.86 40.56,5.84 C45.2 ; 45.07,6.07 P1.1
  Top Layer w1: 38.26,6.06 38.26,5.84 ; 38.26,5.84 38.24,5.84 38.17,5.92 ; 38.26,5.84 38.26,5.02 38.24,5 ; 38.26,5.84 40.56,5.84 40.71,5.86 ; 40.71,5.86 40.54,5.86 ; 40.71,5.86 43.08,5.86 43.8,5.14
M_OUTB: length 20.2
  Top Layer w0.8: 44.13,2.6 44.83,1.9 49.94,1.9 49.23,2.6 44.13,2.6 ; 44.13,2.6 P1.2 ; 44.13,2.6 43.14,2.6
  Top Layer w1: 40.33,2.58 43.12,2.58 43.14,2.6 43.69,3.14 ; 38.05,3.28 38.05,2.85 40.42,2.85 40.64,2.64
RTS: length 9.7
  Top Layer w0.2: U3.6 24.37,53.45 24.99,52.84 R4.1
  Top Layer w0.203: R4.1 25.03,52.14 25.51,51.66 25.51,50.88 24.6,49.97 21.94,49.97 20.57,51.35 Q2.2
U0TX: length 16.3
  Top Layer w0.152: U2.49 39.14,51.06 arc(39.03,51.13) 38.9,51.16 arc(38.78,51.13) 38.67,51.06 38.64,51.06 37.15,49.56 37.15,49 v3(36.94,48.79)
  Top Layer w0.18: v1(31.23,47.35) 34.51,47.35 35.43,48.28 36.42,48.28 v3(36.94,48.79)
  Top Layer w0.203: 27.28,50.73 27.28,51.53 27.31,51.55
  Bottom Layer w0.18: v1(31.23,47.35) 27.85,50.74 v1(27.31,50.74)
USB_5V: length 17
  Top Layer w0.4: U6.A4 v6(7.58,52.92) ; v6(12.13,52.9) 13.07,51.96 13.07,50.17 11.03,48.12 U6.A9
  VCC w0.4: v6(7.58,52.92) 12.11,52.92 v6(12.13,52.9)
USB_D+: length 22.6
  Top Layer w0.241: U4.15 13.55,57.2 v1(12.93,56.58) 12.71,56.58 10.54,54.41 10.54,52.27 9.04,50.77 6.86,50.77 ; 13.8,60.88 13.75,60.93 v1(12.96,60.93) ; U6.B6 6.8,49.77 7.11,50.08 7.11,50.53 6.86,50.77 ; 6.86,50.77 U6.A6
  Bottom Layer w0.241: v1(12.96,60.93) 12.96,56.61 v1(12.93,56.58) 12.93,54.89 TP1.1 ; 11.81,59.45 12.42,59.45 12.95,58.92
USB_D-: length 19.8
  Top Layer w0.241: 13.6,57.77 13.6,60.01 13.78,60.19 ; 12.23,56.65 12.16,56.65 v1(11.89,56.93) ; 12.23,56.65 10.1,54.52 10.1,52.39 8.98,51.27 U6.B7 5.42,51.27 5.18,51.03 5.18,50.51 5.42,50.27 U6.A7 ; 12.23,56.65 13.31,57.73 14.34,57.73 14.38,57.69
  Bottom Layer w0.241: v1(11.89,56.93) 11.89,54.87 TP2.1
XIN: length 2.3
  Top Layer w0.2: 18.46,57.14 19.73,57.14 20.49,57.9
XOUT: length 4.4
  Top Layer w0.2: 22.22,56.04 22.22,56.38 21.71,56.89 20.16,56.89 19.98,56.71 18.46,56.71
XTAL_N: length 6
  Top Layer w0.203: U2.53 40.73,51.73 arc(41.04,51.53) 41.4,51.45 41.76,51.45 arc(41.93,51.39) 42,51.22 C12.1 42.1,50.79 42.1,48.05 41.88,47.83 X2.3
XTAL_P: length 2.4
  Top Layer w0.203: C14.2 L4.2 42.94,49.47
$1N4043: length 1.5
  Top Layer w0.3: 7.6,48.78 7.59,48.77 U6.B5
$1N4044: length 1.5
  Top Layer w0.3: 7.6,51.78 7.59,51.77 U6.A5
$1N4145: length 1.3
  Top Layer w0.2: R5.2 18.57,51.32 Q2.1
$1N4146: length 4.1
  Top Layer w0.2: Q1.1 22.08,51.4 23.03,50.45 24.53,50.45 24.96,50.88 24.96,51.25 R4.2
$1N15135: length 3.7
  Top Layer w0.203: 41.49,54.83 41.49,54.64 41.07,54.23 ; 41.49,54.83 41.49,55.21 ; 41.49,54.83 41.31,55.01 41.29,55.01 41.17,54.89 ; 41.17,54.89 40.79,54.51 ; 41.17,54.89 41.17,55.15
  Top Layer w0.508: 41.32,55.15 41.32,56.42 41.31,56.43
$1N27024: length 2.4
  Top Layer w0.203: 41.76,54.34 U2.1
  Top Layer w0.35: 43.09,55.72 43.09,55.71 L2.1 ; 42.37,54.95 41.76,54.34
$1N27033: length 3.8
  Top Layer w0.35: U1.2 47.26,55.72 L1.1 ; 43.96,55.72 44.99,55.72
$1N27209: length 2.3
  Top Layer w0.203: 42.94,51.79 41.41,51.79 arc(41.25,51.82) 41.12,51.9 40.79,52.24
$2N2515: length 2.1
  Top Layer w0.4: 32.73,16.05 31.46,17.32 31.14,17.32
$2N2516: length 8.9
  Top Layer w0.4: 32.81,19.91 31.54,18.64 31.13,18.64
  Top Layer w0.6: 31.48,22.44 31.55,22.36 31.55,23.18 ; 32.72,20.67 32.76,20.71
  Top Layer w0.8: 32.76,20.71 32.76,21.15 31.55,22.36 31.55,21.2 31,20.66 ; 31.05,20.67 32.72,20.67
$2N2519: length 1.4
  Top Layer w0.4: 37.93,15.3 37.83,15.2 36.61,15.2
$2N2520: length 3.6
  Top Layer w0.4: 36.72,22.75 36.69,22.72 35.33,22.72 ; 35.33,22.72 35.31,22.72 ; 35.33,22.72 35.33,20.58 35.31,20.57
$2N2522: length 3.2
  Top Layer w0.6: 38.37,20.79 36.73,20.79 36.72,20.78 ; 38.48,19.45 38.48,20.89 38.54,20.95
$2N2707: length 1.4
  Top Layer w0.6: 39.97,19.37 39.97,18.05 40.05,17.96
$2N2891: length 1.9
  Top Layer w0.4: 36.77,25.9 36.77,24.09 36.7,24.02
$3N3799: length 6.3
  Top Layer w0.4: 43.94,36.87 43.94,36.85 43.94,36.85 ; 43.94,36.85 43.94,36.53 44.72,35.74 46.64,35.74 47.8,34.58 CN3.3 ; 43.94,36.85 42.86,36.85
$3N3817: length 3.3
  Top Layer w0.2: 44.78,36.94 arc(44.78,36.9) 44.81,36.87
  Top Layer w0.203: R21.2 44.83,38.84 44.73,38.74
  Top Layer w0.4: 44.81,36.87 R21.2 45.87,36.87 R22.1
$3N4028: length 3.7
  Top Layer w0.4: CN3.4 50.06,34.63 50.06,36.89 50.14,36.97 ; R26.2 49.12,36.95 arc(49.11,36.95) R24.1
$3N4031: length 3.1
  Top Layer w0.203: 48.13,38.78 48.13,38.72 48.24,38.62 R24.2
  Top Layer w0.4: R24.2 47.01,36.96 47.01,36.97
$3N4599: length 4
  Top Layer w0.4: 49.6,26.26 49.94,26.59 arc(50.37,27.24) 50.52,28.01 50.52,28.87 ; 50.43,28.89 49.34,28.89 arc(49.33,28.89) 49.32,28.88
$3N4605: length 13.2
  Top Layer w0.203: R37.1 52.16,37.89 52.16,33.28 48.48,29.6 R33.2
  Top Layer w0.4: 48.46,28.93 47.4,28.93 arc(47.34,28.92) 47.29,28.88
$3N4615: length 16.8
  Top Layer w0.203: 45.12,28.87 45.12,29.7 46.6,31.18 46.6,31.35 46.95,31.7 49.76,31.7 51.76,33.7 51.76,37.48 51.39,37.85 50.71,37.85 49.94,38.62 R36.1
  Top Layer w0.4: 46.35,28.92 45.2,28.92 arc(45.16,28.91) 45.12,28.9 arc(45.06,28.88) 45.01,28.84
$3N4618: length 6.5
  Top Layer w0.4: 44.21,28.9 43.02,28.9 arc(43.02,28.9) 43.01,28.91 ; 44.19,28.88 44.19,28.1 arc(44.21,28) 44.27,27.91 arc(44.55,27.72) 44.88,27.66 47.01,27.66 arc(47.41,27.06) 47.55,26.35 47.55,26.32
$3N6168: length 1.1
  Top Layer w0.18: 25.83,43.05 25.96,42.91 U10.4

## Copper pours and planes (outline as drawn; the poured copper is in the pictures)
3V3 on Top Layer: 22.58,48.88 26.91,48.88 26.91,45.25 22.58,45.25
3V3 on VCC: -3.02,66.43 13.91,66.43 13.91,55.9 -3.02,55.9
3V3 on VCC: 13.41,64.8 42.91,64.8 42.91,45.26 13.41,45.26
12V on VCC: 0.01,15.27 53.01,15.27 53.01,-0.2 0.01,-0.2
12V on VCC: 0.01,39.28 19.66,39.28 19.66,3.82 0.01,3.82
+5V on VCC: -1.42,45.25 42.83,45.25 42.83,40.07 -1.42,40.07
+5V on VCC: -2.94,48.95 13.13,48.95 13.13,43.03 -2.94,43.03
+5V on VCC: 20.33,41.83 56.88,41.83 56.88,15.58 20.33,15.58
GND on Top Layer: -7.14,64.8 64.39,64.8 64.39,-7.6 -7.14,-7.6
GND on Bottom Layer: -0.47,64.25 53.31,64.25 53.31,-0.13 -0.47,-0.13
GND on GND: 0.01,64 53.01,64 53.01,0 0.01,0

## Text on the board
Bottom Silkscreen Layer: D- | GND | D+ | 3.3V | 5V | 12V | RX | TX | 6-12V | !! NON-STANDARD ETHERNET !! | John Dews-Flick 2025 | Motor Sense
Top Silkscreen Layer: 3.3V | GND | IO13 | IO14 | 5V | IO11 | IO12 | END | CAM | 12V | MOTOR OUT | JohnDews.com | 2025 | BOOT | RST
